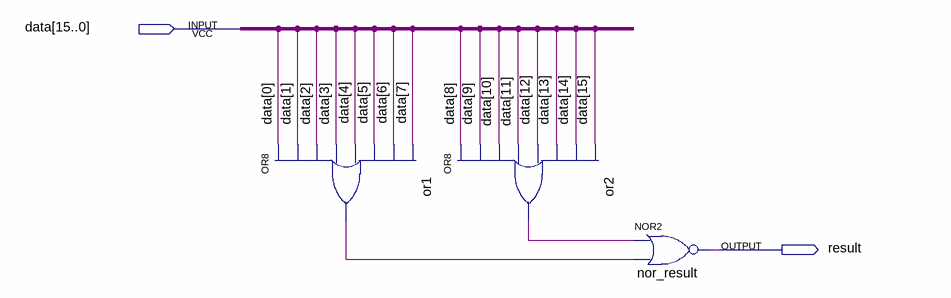
[diagram p0: schematic sheet]
// Quartus schematic isZero.bdf as structural Verilog: 3 symbols, 2 pins
module isZero (
  input  [15:0] data,
  output result
);

  wire or1_out, or2_out;

  or or1 (or1_out, data[0], data[1], data[2], data[3], data[4], data[5], data[6], data[7]);
  or or2 (or2_out, data[8], data[9], data[10], data[11], data[12], data[13], data[14], data[15]);
  nor nor_result (result, or2_out, or1_out);
endmodule
